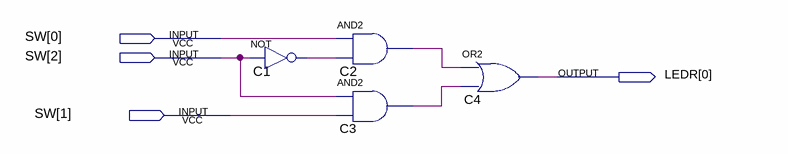
[diagram p0: schematic sheet]
// Quartus schematic Lab1Mux.bdf as structural Verilog: 4 symbols, 4 pins
module Lab1Mux (
  input  [2:0] SW,
  output [0:0] LEDR
);

  wire C1_out, C2_out, C3_out;

  not C1 (C1_out, SW[2]);
  and C2 (C2_out, SW[0], C1_out);
  and C3 (C3_out, SW[2], SW[1]);
  or C4 (LEDR[0], C2_out, C3_out);
endmodule
